# Altium schematic sheet 03_Beam_Inputs.SchDoc: BEAM INPUTS
size A4; Author: Henrique Rosa; DrawnBy: Henq / Codex; Engineer: Henrique Rosa; Address1: rua; Address: Bairro; Address3: São Paulo, SP - Brasil; Address4: 55 (11) 9 6825-6715; DocumentNumber: GBS-02; Revision: A; SheetNumber: 03; SheetTotal: 06; Site: henq.com; VersionControl_RevNumber: 03; PageSetup: Record=PageOptions|CenterHorizontal=True|CenterVertical=True|PrintScale=0.98|XCorrection=1.00|YCorrection=1.00|PrintKind=0|BorderSize=5000000|LeftOffset=0|BottomOffset=0|Orientation=2|PaperLength=1000|PaperWidth=1000|Scale=100|PaperSource=7|PrintQuality=-3|MediaType=1|DitherType=10|PrintScaleMode=1|PaperKind=A4|PaperIndex=9
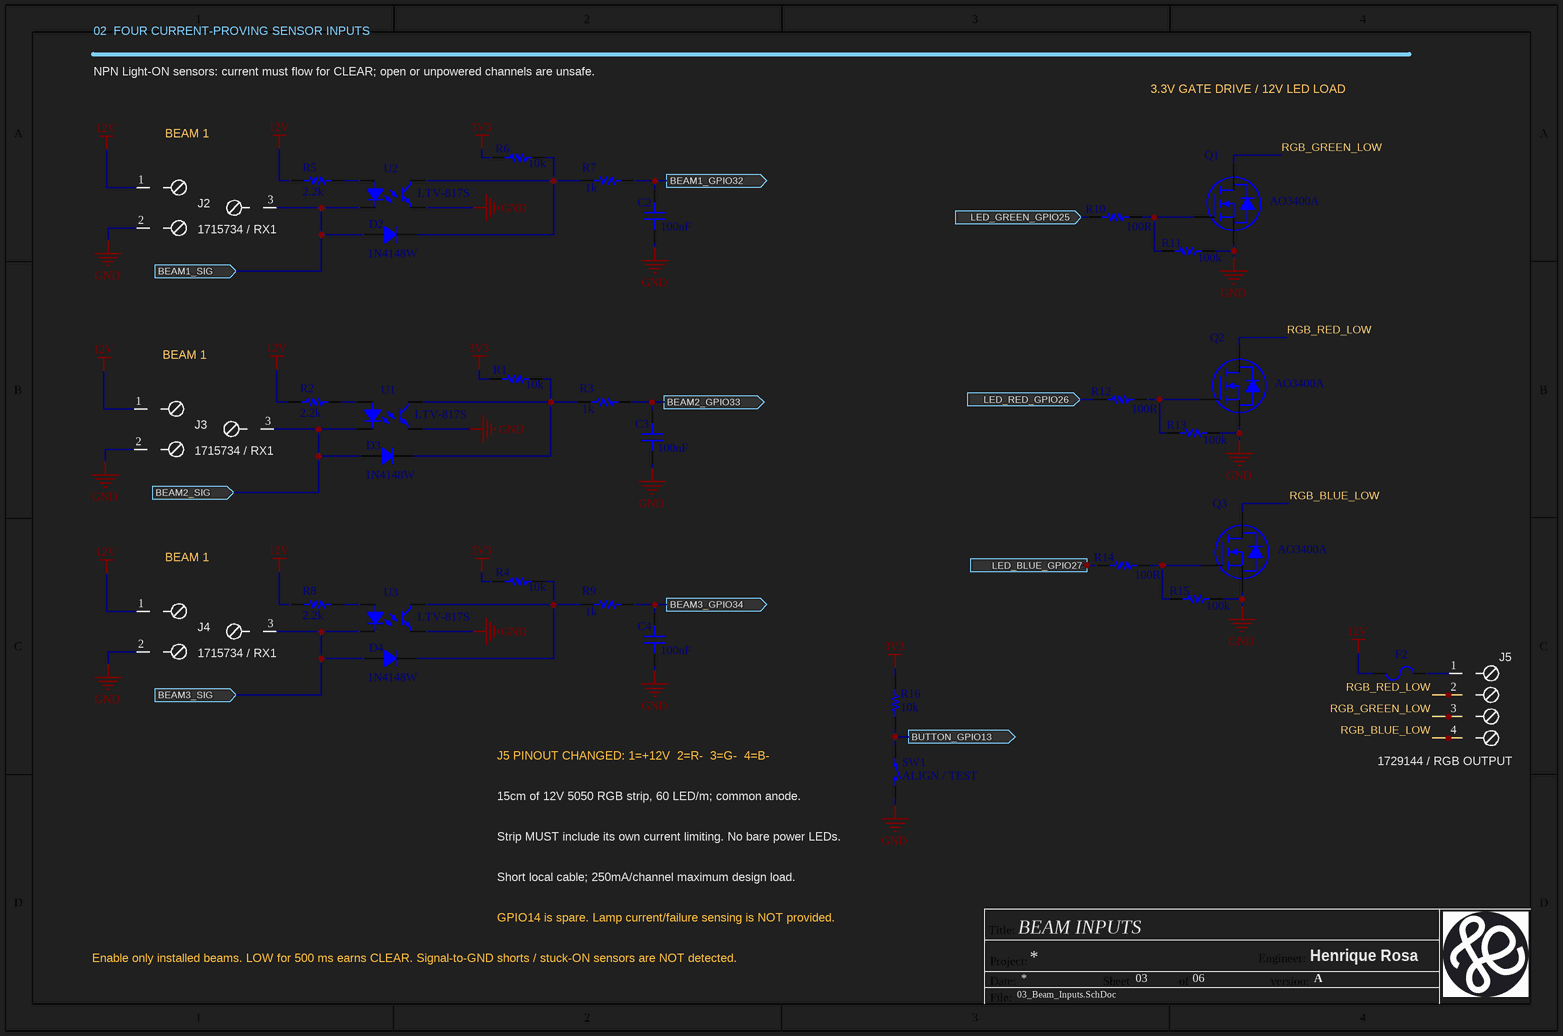
[diagram p0: 03_Beam_Inputs.SchDoc]

## Parts
C2  100nF  [MURATA GRM21B 0805_2012]
C3  100nF  [MURATA GRM21B 0805_2012]
C4  100nF  [MURATA GRM21B 0805_2012]
D2  1N4148W  [1N4148W_SOD123_A1_K2]
D3  1N4148W  [1N4148W_SOD123_A1_K2]
D4  1N4148W  [1N4148W_SOD123_A1_K2]
F2  0.5A FAST  [LITTELFUSE_0451_2410]  (value not drawn)
J2  1715734 / RX1  [PHOENIX_1715734_MKDS_3_508]
J3  1715734 / RX1  [PHOENIX_1715734_MKDS_3_508]
J4  1715734 / RX1  [PHOENIX_1715734_MKDS_3_508]
J5  1729144 / RGB OUTPUT  [PHOENIX_1729144_MKDSN_4_508]
Q1  AO3400A  [AO3400A_G1_S2_D3]
Q2  AO3400A  [AO3400A_G1_S2_D3]
Q3  AO3400A  [AO3400A_G1_S2_D3]
R1  10k  [YAGEO RES 0805_2012]
R2  2.2k  [YAGEO RES 0805_2012]
R3  1k  [YAGEO RES 0805_2012]
R4  10k  [YAGEO RES 0805_2012]
R5  2.2k  [YAGEO RES 0805_2012]
R6  10k  [YAGEO RES 0805_2012]
R7  1k  [YAGEO RES 0805_2012]
R8  2.2k  [YAGEO RES 0805_2012]
R9  1k  [YAGEO RES 0805_2012]
R10  100R  [YAGEO RES 0805_2012]
R11  100k  [YAGEO RES 0805_2012]
R12  100R  [YAGEO RES 0805_2012]
R13  100k  [YAGEO RES 0805_2012]
R14  100R  [YAGEO RES 0805_2012]
R15  100k  [YAGEO RES 0805_2012]
R16  10k  [YAGEO RES 0805_2012]
SW1  ALIGN / TEST  [OMRON_B3FS1000P_LOGICAL_1_2]
U1  LTV-817S  [LITEON LTV-817]
U2  LTV-817S  [LITEON LTV-817]
U3  LTV-817S  [LITEON LTV-817]

## Ports
BEAM1_GPIO32 (out), BEAM1_SIG (in), BEAM2_GPIO33 (out), BEAM2_SIG (in), BEAM3_GPIO34 (out), BEAM3_SIG (in), BUTTON_GPIO13 (out), LED_BLUE_GPIO27 (in), LED_GREEN_GPIO25 (in), LED_RED_GPIO26 (in)

## Nets
3V3: R1.1 R4.1 R6.1 R16.1
12V: F2.1 J2.1(+12V) J3.1(+12V) J4.1(+12V) R2.1 R5.1 R8.1
GND: C2.1 C3.1 C4.1 J2.2(0V) J3.2(0V) J4.2(0V) Q1.2(S) Q2.2(S) Q3.2(S) R11.2 R13.2 R15.2 SW1.2 U1.3 U2.3 U3.3
BEAM1_GPIO32: C2.2 R7.2 ; port BEAM1_GPIO32
BEAM1_SIG: D2.1 J2.3(OUT) U2.2 ; port BEAM1_SIG
BEAM2_GPIO33: C3.2 R3.2 ; port BEAM2_GPIO33
BEAM2_SIG: D3.1 J3.3(OUT) U1.2 ; port BEAM2_SIG
BEAM3_GPIO34: C4.2 R9.2 ; port BEAM3_GPIO34
BEAM3_SIG: D4.1 J4.3(OUT) U3.2 ; port BEAM3_SIG
BUTTON_GPIO13: R16.2 SW1.1 ; port BUTTON_GPIO13
LED_BLUE_GPIO27: R14.1 ; port LED_BLUE_GPIO27
LED_GREEN_GPIO25: R10.1 ; port LED_GREEN_GPIO25
LED_RED_GPIO26: R12.1 ; port LED_RED_GPIO26
RGB_BLUE_LOW: J5.4(B-) Q3.3(D)
RGB_GREEN_LOW: J5.3(G-) Q1.3(D)
RGB_RED_LOW: J5.2(R-) Q2.3(D)
NetD2_2: D2.2 R6.2 R7.1 U2.4
NetD3_2: D3.2 R1.2 R3.1 U1.4
NetD4_2: D4.2 R4.2 R9.1 U3.4
NetF2_2: F2.2 J5.1(+12V)
NetQ1_1: Q1.1(G) R10.2 R11.1
NetQ2_1: Q2.1(G) R12.2 R13.1
NetQ3_1: Q3.1(G) R14.2 R15.1
NetR2_2: R2.2 U1.1
NetR5_2: R5.2 U2.1
NetR8_2: R8.2 U3.1

## Notes on the sheet
- 02  FOUR CURRENT-PROVING SENSOR INPUTS
- NPN Light-ON sensors: current must flow for CLEAR; open or unpowered channels are unsafe.
- 3.3V GATE DRIVE / 12V LED LOAD
- (near J2) BEAM 1
- (near J3) BEAM 1
- (near J4) BEAM 1
- J5 PINOUT CHANGED: 1=+12V  2=R-  3=G-  4=B-
- 15cm of 12V 5050 RGB strip, 60 LED/m; common anode.
- (near SW1) Strip MUST include its own current limiting. No bare power LEDs.
- Short local cable; 250mA/channel maximum design load.
- GPIO14 is spare. Lamp current/failure sensing is NOT provided.
- Enable only installed beams. LOW for 500 ms earns CLEAR. Signal-to-GND shorts / stuck-ON sensors are NOT detected.
- Title:
- Project:
- Date:
- Sheet
- of
- Engineer:
- version:
- File:
- Title
- Size:
- A4
- Number:
- Time:
- Revision:

## Library data of the parts
C2-C4 = Capacitor: SMT Capacitor; Part Number: GRM21BR71H104KA01L; Manufacturer: Murata; Symbol source: Celestial / SCH - PASSIVES - CAPACITOR.SCHLIB / Capacitor; CAD status: Complete native symbol loaded; repair COPY requires visual and compiled connectivity validation; Valor: 100nF; Manufacturer Part Number: GRM21BR71H104KA01L; Intended footprint: MURATA GRM21B 0805_2012; Footprint source: Celestial Altium Library / Mark Harris / https://altiumlibrary.com; Value: 100nF
D2-D4 = Diode: Rectifier Diode; Manufacturer: Nexperia; Symbol source: Celestial / SCH - DIODES - DIODE.SCHLIB / Diode; CAD status: Complete native symbol loaded; repair COPY requires visual and compiled connectivity validation; Value: 1N4148W; Part Number: 1N4148W; Manufacturer Part Number: 1N4148W; Intended footprint: 1N4148W_SOD123_A1_K2; Footprint source: Local PinRepairFootprints.PcbLib; source and polarity checked
F2 = MOUNTED FUSE: GENERIC_fuse; Manufacturer: Littelfuse; Manufacturer Part Number: 0451.500MRL; Populate: Yes; Value: 0451.500MRL; Symbol source: Celestial / SCH - FUSE - MOUNTED FUSE.Schlib / MOUNTED FUSE; CAD status: Complete native symbol loaded; repair COPY requires visual and compiled connectivity validation; Package: FUSE_2410; Intended footprint: LITTELFUSE_0451_2410; Footprint source: Local PinRepairFootprints.PcbLib; source and polarity checked; Part Number: 0451.500MRL
J2-J4 = *: 12V / GND / NPN signal terminal; Manufacturer: Phoenix Contact; Populate: Yes; CAD status: Reusable reviewed symbol; pin/pad check performed by refresh. Native ERC, PCB ECO and 3D mechanical inspection still required.; Wiring: 1 brown +12V; 2 blue 0V; 3 black NPN output; Symbol provenance: Project-authored native Altium library; based on identified manufacturer part and pinout, not vendor-issued CAD; Component refresh: 2026-09-10 sourced-symbol pass; not manufacturing release; Symbol adaptation: Keep existing part-specific symbol; package and procurement metadata retained.; Manufacturer Part Number: 1715734; Package: MKDS 1,5/3-5,08; Intended footprint: PHOENIX_1715734_MKDS_3_508; Datasheet: https://www.phoenixcontact.com/en-us/products/printed-circuit-board-terminal-mkds-15-3-508-1715734; Part Number: 1715734; Value: 1715734
J5 = *: Common-anode analogue RGB strip; NOT addressable; Manufacturer: Phoenix Contact; Populate: Yes; CAD status: Reusable reviewed symbol; pin/pad check performed by refresh. Native ERC, PCB ECO and 3D mechanical inspection still required.; Symbol provenance: Project-authored native Altium library; based on identified manufacturer part and pinout, not vendor-issued CAD; Component refresh: 2026-09-10 sourced-symbol pass; not manufacturing release; Symbol adaptation: Keep existing part-specific symbol; package and procurement metadata retained.; Manufacturer Part Number: 1729144; Package: TERM_4_508; Intended footprint: PHOENIX_1729144_MKDSN_4_508; Part Number: 1729144; Value: 1729144
Q1-Q3 = MOSFET SINGLE GDS: Manufacturer: Alpha and Omega Semiconductor; Populate: Yes; 3D asset: lib/upstream-kicad/SOT-23.step; downloaded, native link pending; Symbol source: Celestial / SCH - FET - N-CH - MOSFET SINGLE GDS.SCHLIB / MOSFET SINGLE GDS; CAD status: Complete native symbol loaded; repair COPY requires visual and compiled connectivity validation; Manufacturer Part Number: AO3400A; Package: Package_TO_SOT_SMD:SOT-23; Intended footprint: AO3400A_G1_S2_D3; Datasheet: https://www.aosmd.com/sites/default/files/res/datasheets/AO3400A.pdf; Footprint source: Local PinRepairFootprints.PcbLib; source and polarity checked; Part Number: AO3400A; Value: AO3400A
R1 R4 R6 R16 = Resistor: SMT Resistor; Part number: RC0805FR-0710KL; Manufacturer: Yageo; Symbol source: Celestial / SCH - PASSIVES - RESISTOR.SCHLIB / Resistor; CAD status: Complete native symbol loaded; repair COPY requires visual and compiled connectivity validation; Valor: 10k; Manufacturer Part Number: RC0805FR-0710KL; Intended footprint: YAGEO RES 0805_2012; Footprint source: Celestial Altium Library / Mark Harris / https://altiumlibrary.com; Value: 10k
R2 R5 R8 = Resistor: SMT Resistor; Part number: RC0805FR-072K2L; Manufacturer: Yageo; Symbol source: Celestial / SCH - PASSIVES - RESISTOR.SCHLIB / Resistor; CAD status: Complete native symbol loaded; repair COPY requires visual and compiled connectivity validation; Valor: 2.2k; Manufacturer Part Number: RC0805FR-072K2L; Intended footprint: YAGEO RES 0805_2012; Footprint source: Celestial Altium Library / Mark Harris / https://altiumlibrary.com; Value: 2.2k
R3 R7 R9 = Resistor: SMT Resistor; Part number: RC0805FR-071KL; Manufacturer: Yageo; Symbol source: Celestial / SCH - PASSIVES - RESISTOR.SCHLIB / Resistor; CAD status: Complete native symbol loaded; repair COPY requires visual and compiled connectivity validation; Valor: 1k; Manufacturer Part Number: RC0805FR-071KL; Intended footprint: YAGEO RES 0805_2012; Footprint source: Celestial Altium Library / Mark Harris / https://altiumlibrary.com; Value: 1k
R10 R12 R14 = Resistor: SMT Resistor; Part number: RC0805FR-07100RL; Manufacturer: Yageo; Symbol source: Celestial / SCH - PASSIVES - RESISTOR.SCHLIB / Resistor; CAD status: Complete native symbol loaded; repair COPY requires visual and compiled connectivity validation; Valor: 100R; Manufacturer Part Number: RC0805FR-07100RL; Intended footprint: YAGEO RES 0805_2012; Footprint source: Celestial Altium Library / Mark Harris / https://altiumlibrary.com; Value: 100R
R11 R13 R15 = Resistor: SMT Resistor; Part number: RC0805FR-07100KL; Manufacturer: Yageo; Symbol source: Celestial / SCH - PASSIVES - RESISTOR.SCHLIB / Resistor; CAD status: Complete native symbol loaded; repair COPY requires visual and compiled connectivity validation; Valor: 100k; Manufacturer Part Number: RC0805FR-07100KL; Intended footprint: YAGEO RES 0805_2012; Footprint source: Celestial Altium Library / Mark Harris / https://altiumlibrary.com; Value: 100k
SW1 = SPST 2PIN: Manufacturer: Omron; Manufacturer Part Number: B3FS-1000P; Populate: Yes; Value: B3FS-1000P; Symbol source: Celestial / SCH - SWITCH - SPST 2PIN.SCHLIB / SPST 2PIN; CAD status: Complete native symbol loaded; repair COPY requires visual and compiled connectivity validation; Package: SW_SMD_6X6; Intended footprint: OMRON_B3FS1000P_LOGICAL_1_2; Footprint source: Local PinRepairFootprints.PcbLib; source and polarity checked; Part Number: B3FS-1000P
U1-U3 = Optoisolator: Manufacturer: Lite-On; Manufacturer Part Number: LTV-817S-TA1; Populate: Yes; Value: LTV-817S-TA1; Symbol source: Celestial / SCH - OPTOISOLATORS - OPTOISOLATOR.SCHLIB / Optoisolator; CAD status: Complete native symbol loaded; repair COPY requires visual and compiled connectivity validation; Package: SMD4; Intended footprint: LITEON LTV-817; Footprint source: Celestial Altium Library / Mark Harris / https://altiumlibrary.com; Valor: LTV-817S; Part Number: LTV-817S-TA1